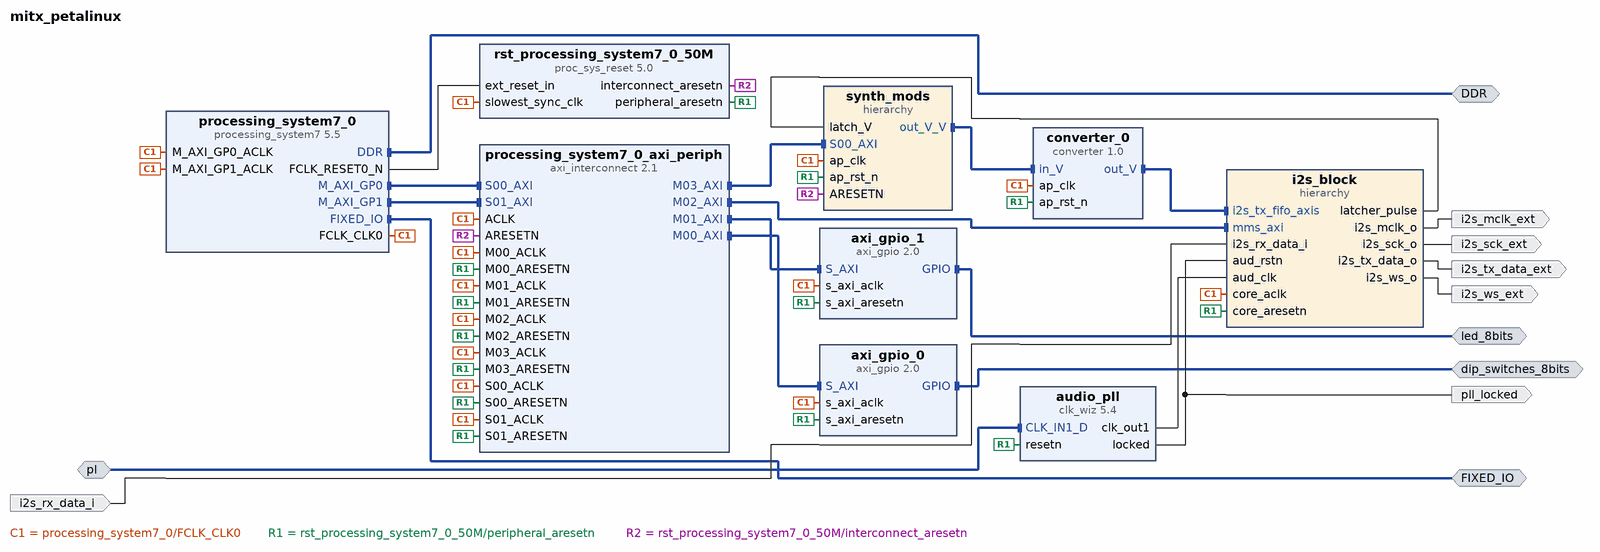
[diagram p0: block diagram of the top level]
# Vivado block design mitx_petalinux, xc7z100ffg900-1, Vivado 2017.2
create_bd_design mitx_petalinux

create_bd_intf_port -mode Master -vlnv xilinx.com:interface:ddrx_rtl:1.0 DDR
create_bd_intf_port -mode Master -vlnv xilinx.com:display_processing_system7:fixedio_rtl:1.0 FIXED_IO
create_bd_intf_port -mode Master -vlnv xilinx.com:interface:gpio_rtl:1.0 dip_switches_8bits
create_bd_intf_port -mode Master -vlnv xilinx.com:interface:gpio_rtl:1.0 led_8bits
create_bd_intf_port -mode Slave -vlnv xilinx.com:interface:diff_clock_rtl:1.0 pl
set_property -dict {CONFIG.FREQ_HZ 200000000} [get_bd_intf_ports pl]
create_bd_port -dir O i2s_sck_ext
create_bd_port -dir O i2s_ws_ext
create_bd_port -dir O i2s_mclk_ext
create_bd_port -dir O i2s_tx_data_ext
create_bd_port -dir I i2s_rx_data_i
create_bd_port -dir O pll_locked

create_bd_cell -type hier i2s_block
create_bd_cell -type ip -vlnv xilinx.com:ip:axi_gpio:2.0 axi_gpio_0
set_property -dict {CONFIG.C_GPIO_WIDTH 8 CONFIG.C_ALL_INPUTS 1} [get_bd_cells axi_gpio_0]
create_bd_cell -type ip -vlnv xilinx.com:ip:axi_gpio:2.0 axi_gpio_1
set_property -dict {CONFIG.C_GPIO_WIDTH 7 CONFIG.C_ALL_OUTPUTS 1} [get_bd_cells axi_gpio_1]
create_bd_cell -type ip -vlnv xilinx.com:ip:clk_wiz:5.4 audio_pll
set_property -dict [list \
  CONFIG.ENABLE_CLOCK_MONITOR false \
  CONFIG.REF_CLK_FREQ 200 \
  CONFIG.PRIMITIVE MMCM \
  CONFIG.PRIM_IN_FREQ 200 \
  CONFIG.JITTER_OPTIONS UI \
  CONFIG.CLKIN1_UI_JITTER 0.050 \
  CONFIG.CLKIN2_UI_JITTER 0.010 \
  CONFIG.CLKIN1_JITTER_PS 250.0 \
  CONFIG.CLKIN2_JITTER_PS 100.0 \
  CONFIG.CLKOUT2_USED false \
  CONFIG.NUM_OUT_CLKS 1 \
  CONFIG.CLKOUT1_REQUESTED_OUT_FREQ 12.288 \
  CONFIG.CLKOUT2_REQUESTED_OUT_FREQ 100.000 \
  CONFIG.PRIM_SOURCE Differential_clock_capable_pin \
  CONFIG.CLKOUT1_DRIVES BUFG \
  CONFIG.CLKOUT2_DRIVES BUFG \
  CONFIG.CLKOUT3_DRIVES BUFG \
  CONFIG.CLKOUT4_DRIVES BUFG \
  CONFIG.CLKOUT5_DRIVES BUFG \
  CONFIG.CLKOUT6_DRIVES BUFG \
  CONFIG.CLKOUT7_DRIVES BUFG \
  CONFIG.FEEDBACK_SOURCE FDBK_AUTO \
  CONFIG.RESET_PORT resetn \
  CONFIG.MMCM_DIVCLK_DIVIDE 9 \
  CONFIG.MMCM_CLKFBOUT_MULT_F 44.375 \
  CONFIG.MMCM_CLKIN1_PERIOD 5.000 \
  CONFIG.MMCM_CLKIN2_PERIOD 10.0 \
  CONFIG.MMCM_COMPENSATION ZHOLD \
  CONFIG.MMCM_REF_JITTER1 0.050 \
  CONFIG.MMCM_REF_JITTER2 0.010 \
  CONFIG.MMCM_CLKOUT0_DIVIDE_F 80.250 \
  CONFIG.MMCM_CLKOUT1_DIVIDE 1 \
  CONFIG.RESET_TYPE ACTIVE_LOW \
  CONFIG.CLKOUT1_JITTER 569.507 \
  CONFIG.CLKOUT1_PHASE_ERROR 264.435 \
  CONFIG.CLKOUT2_JITTER 143.127 \
  CONFIG.CLKOUT2_PHASE_ERROR 134.075 \
] [get_bd_cells audio_pll]
create_bd_cell -type ip -vlnv xilinx.com:ip:processing_system7:5.5 processing_system7_0
set_property -dict [list \
  CONFIG.PCW_UIPARAM_DDR_FREQ_MHZ 533.333313 \
  CONFIG.PCW_APU_PERIPHERAL_FREQMHZ 667.000000 \
  CONFIG.PCW_SDIO_PERIPHERAL_FREQMHZ 50 \
  CONFIG.PCW_UART_PERIPHERAL_FREQMHZ 50 \
  CONFIG.PCW_I2C_PERIPHERAL_FREQMHZ 111.111115 \
  CONFIG.PCW_FPGA0_PERIPHERAL_FREQMHZ 100 \
  CONFIG.PCW_USE_M_AXI_GP1 1 \
  CONFIG.PCW_GP0_EN_MODIFIABLE_TXN 0 \
  CONFIG.PCW_GP1_EN_MODIFIABLE_TXN 0 \
  CONFIG.PCW_PERIPHERAL_BOARD_PRESET part0 \
  CONFIG.PCW_PRESET_BANK0_VOLTAGE {LVCMOS 1.8V} \
  CONFIG.PCW_PRESET_BANK1_VOLTAGE {LVCMOS 1.8V} \
  CONFIG.PCW_UIPARAM_DDR_PARTNO Custom \
  CONFIG.PCW_QSPI_PERIPHERAL_ENABLE 1 \
  CONFIG.PCW_QSPI_QSPI_IO {MIO 1 .. 6} \
  CONFIG.PCW_QSPI_GRP_SINGLE_SS_ENABLE 1 \
  CONFIG.PCW_QSPI_GRP_SINGLE_SS_IO {MIO 1 .. 6} \
  CONFIG.PCW_QSPI_GRP_FBCLK_ENABLE 1 \
  CONFIG.PCW_QSPI_GRP_FBCLK_IO {MIO 8} \
  CONFIG.PCW_ENET0_PERIPHERAL_ENABLE 1 \
  CONFIG.PCW_ENET0_ENET0_IO {MIO 16 .. 27} \
  CONFIG.PCW_ENET0_GRP_MDIO_ENABLE 1 \
  CONFIG.PCW_ENET0_GRP_MDIO_IO {MIO 52 .. 53} \
  CONFIG.PCW_ENET_RESET_ENABLE 1 \
  CONFIG.PCW_ENET_RESET_SELECT {Share reset pin} \
  CONFIG.PCW_ENET0_RESET_ENABLE 1 \
  CONFIG.PCW_ENET0_RESET_IO {MIO 47} \
  CONFIG.PCW_SD0_PERIPHERAL_ENABLE 1 \
  CONFIG.PCW_SD0_SD0_IO {MIO 40 .. 45} \
  CONFIG.PCW_SD0_GRP_CD_ENABLE 1 \
  CONFIG.PCW_SD0_GRP_CD_IO {MIO 14} \
  CONFIG.PCW_SD0_GRP_WP_ENABLE 1 \
  CONFIG.PCW_SD0_GRP_WP_IO EMIO \
  CONFIG.PCW_UART1_PERIPHERAL_ENABLE 1 \
  CONFIG.PCW_UART1_UART1_IO {MIO 48 .. 49} \
  CONFIG.PCW_TTC0_PERIPHERAL_ENABLE 1 \
  CONFIG.PCW_TTC0_TTC0_IO EMIO \
  CONFIG.PCW_PJTAG_PERIPHERAL_ENABLE 1 \
  CONFIG.PCW_PJTAG_PJTAG_IO {MIO 10 .. 13} \
  CONFIG.PCW_USB0_PERIPHERAL_ENABLE 1 \
  CONFIG.PCW_USB0_USB0_IO {MIO 28 .. 39} \
  CONFIG.PCW_USB_RESET_ENABLE 1 \
  CONFIG.PCW_USB_RESET_SELECT {Share reset pin} \
  CONFIG.PCW_USB0_RESET_ENABLE 1 \
  CONFIG.PCW_USB0_RESET_IO {MIO 7} \
  CONFIG.PCW_I2C0_PERIPHERAL_ENABLE 1 \
  CONFIG.PCW_I2C0_I2C0_IO {MIO 50 .. 51} \
  CONFIG.PCW_I2C0_RESET_ENABLE 1 \
  CONFIG.PCW_I2C0_RESET_IO {MIO 46} \
  CONFIG.PCW_I2C_RESET_ENABLE 1 \
  CONFIG.PCW_I2C_RESET_SELECT {Share reset pin} \
  CONFIG.PCW_GPIO_MIO_GPIO_ENABLE 1 \
  CONFIG.PCW_GPIO_MIO_GPIO_IO MIO \
] [get_bd_cells processing_system7_0]
# 209 more settings of processing_system7_0 are not shown: defaults, MIO pin electricals, DDR timing, and values the tool derives
create_bd_cell -type ip -vlnv xilinx.com:ip:proc_sys_reset:5.0 rst_processing_system7_0_50M
create_bd_cell -type hier synth_mods
create_bd_cell -type ip -vlnv xilinx.com:hls:converter:1.0 converter_0
create_bd_cell -type ip -vlnv xilinx.com:ip:axi_interconnect:2.1 processing_system7_0_axi_periph
set_property -dict {CONFIG.NUM_SI 2 CONFIG.NUM_MI 4} [get_bd_cells processing_system7_0_axi_periph]

# ---- hierarchy /i2s_block ----
current_bd_instance /i2s_block
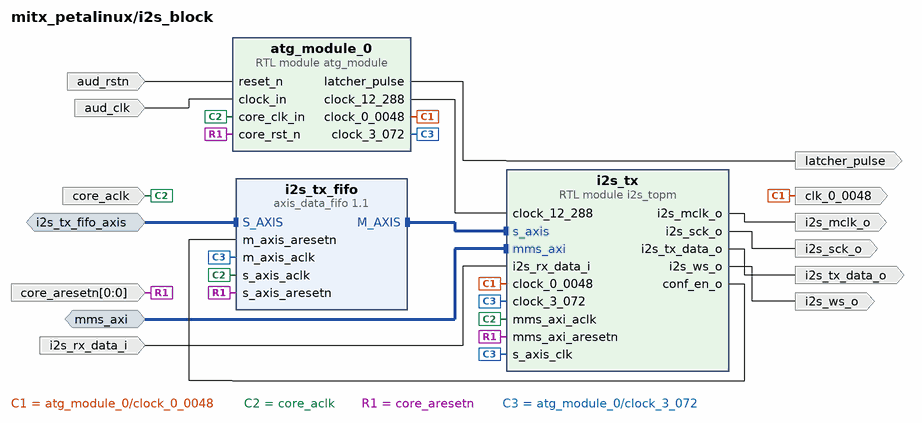
[diagram p1: block diagram inside /i2s_block]
create_bd_intf_pin -mode Slave -vlnv xilinx.com:interface:axis_rtl:1.0 i2s_tx_fifo_axis
create_bd_intf_pin -mode Slave -vlnv xilinx.com:interface:aximm_rtl:1.0 mms_axi
create_bd_pin -dir O i2s_sck_o
create_bd_pin -dir O i2s_ws_o
create_bd_pin -dir O i2s_mclk_o
create_bd_pin -dir O i2s_tx_data_o
create_bd_pin -dir I i2s_rx_data_i
create_bd_pin -dir I -type rst aud_rstn
create_bd_pin -dir I -from 0 -to 0 -type rst core_aresetn
create_bd_pin -dir I -type clk core_aclk
create_bd_pin -dir O clk_0_0048
create_bd_pin -dir O latcher_pulse
create_bd_pin -dir I -type clk aud_clk

create_bd_cell -type ip -vlnv xilinx.com:ip:axis_data_fifo:1.1 i2s_tx_fifo
set_property -dict [list \
  CONFIG.TDATA_NUM_BYTES 4 \
  CONFIG.FIFO_DEPTH 64 \
  CONFIG.FIFO_MODE 1 \
  CONFIG.IS_ACLK_ASYNC 1 \
] [get_bd_cells i2s_tx_fifo]
create_bd_cell -type module -reference atg_module atg_module_0
create_bd_cell -type module -reference i2s_topm i2s_tx

# ---- hierarchy /synth_mods ----
current_bd_instance /synth_mods
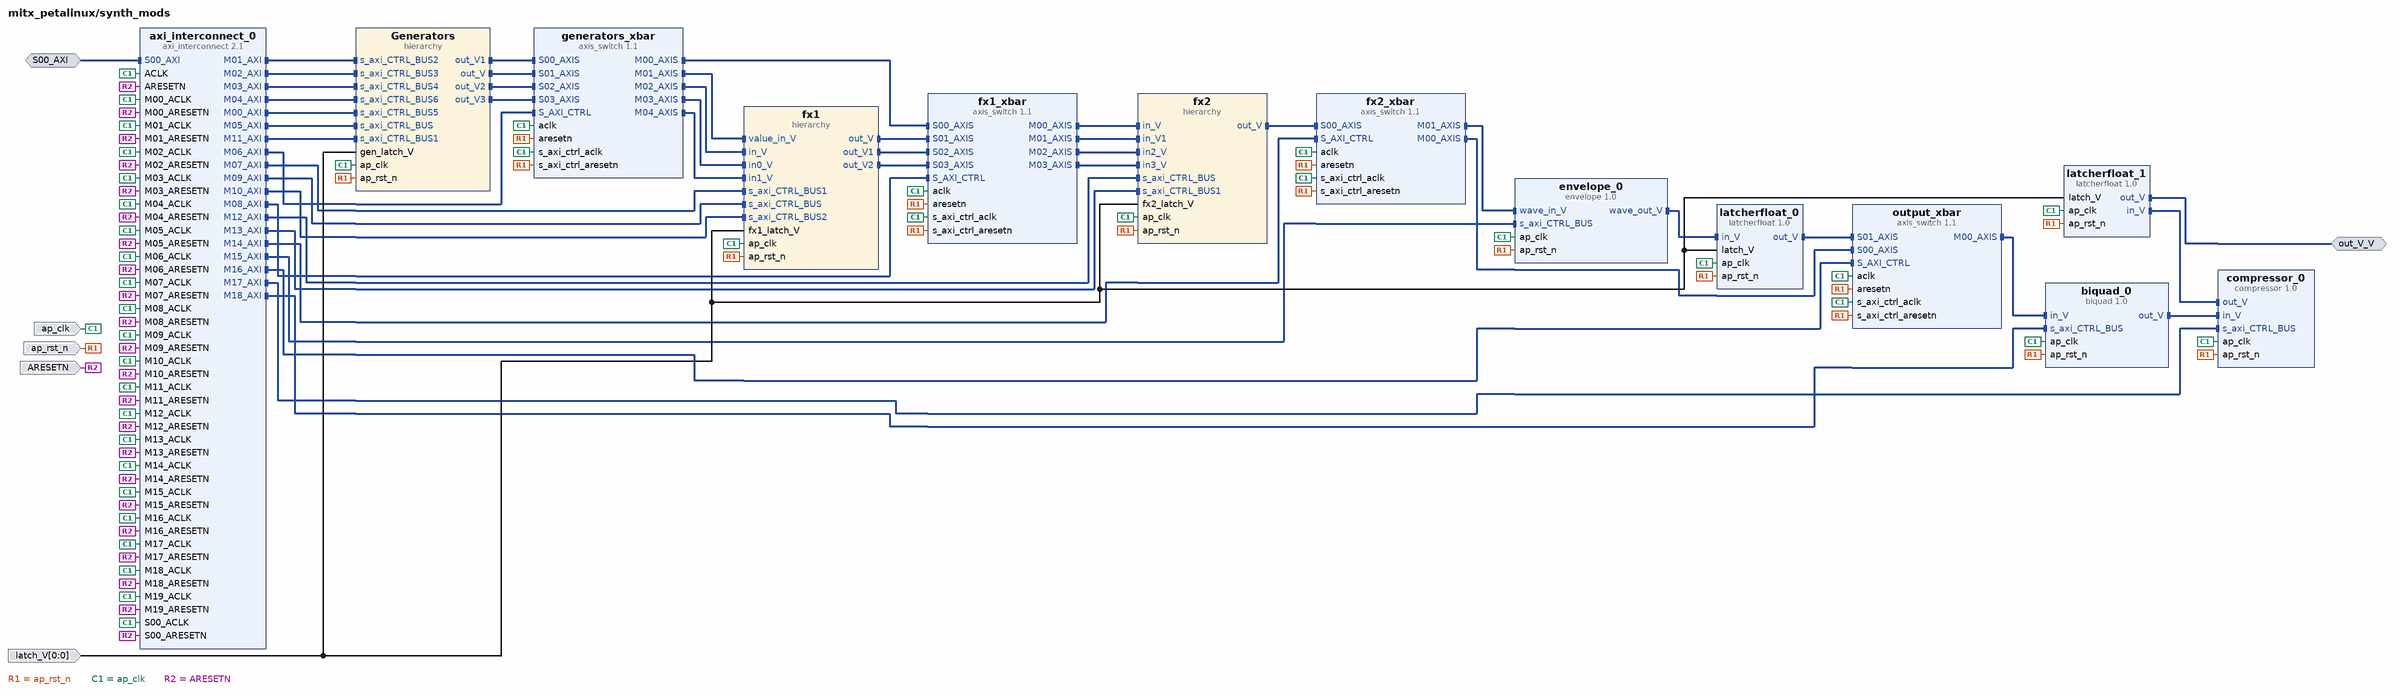
[diagram p2: block diagram inside /synth_mods]
create_bd_intf_pin -mode Master -vlnv xilinx.com:interface:axis_rtl:1.0 out_V_V
create_bd_intf_pin -mode Slave -vlnv xilinx.com:interface:aximm_rtl:1.0 S00_AXI
create_bd_pin -dir I -type clk ap_clk
create_bd_pin -dir I -type rst ap_rst_n
create_bd_pin -dir I -from 0 -to 0 -type data latch_V
create_bd_pin -dir I -type rst ARESETN

create_bd_cell -type ip -vlnv xilinx.com:ip:axis_switch:1.1 generators_xbar
set_property -dict {CONFIG.NUM_SI 4 CONFIG.NUM_MI 5 CONFIG.ROUTING_MODE 1 CONFIG.DECODER_REG 1} [get_bd_cells generators_xbar]
create_bd_cell -type ip -vlnv xilinx.com:ip:axis_switch:1.1 fx1_xbar
set_property -dict {CONFIG.NUM_SI 4 CONFIG.NUM_MI 4 CONFIG.ROUTING_MODE 1 CONFIG.DECODER_REG 1} [get_bd_cells fx1_xbar]
create_bd_cell -type ip -vlnv xilinx.com:ip:axis_switch:1.1 fx2_xbar
set_property -dict {CONFIG.NUM_SI 1 CONFIG.NUM_MI 2 CONFIG.ROUTING_MODE 1 CONFIG.DECODER_REG 1} [get_bd_cells fx2_xbar]
create_bd_cell -type ip -vlnv xilinx.com:ip:axis_switch:1.1 output_xbar
set_property -dict {CONFIG.ROUTING_MODE 1} [get_bd_cells output_xbar]
create_bd_cell -type hier Generators
create_bd_cell -type hier fx1
create_bd_cell -type hier fx2
create_bd_cell -type ip -vlnv xilinx.com:hls:latcherfloat:1.0 latcherfloat_0
create_bd_cell -type ip -vlnv xilinx.com:hls:latcherfloat:1.0 latcherfloat_1
create_bd_cell -type ip -vlnv xilinx.com:ip:axi_interconnect:2.1 axi_interconnect_0
set_property -dict {CONFIG.NUM_MI 20} [get_bd_cells axi_interconnect_0]
create_bd_cell -type ip -vlnv xilinx.com:hls:compressor:1.0 compressor_0
create_bd_cell -type ip -vlnv xilinx.com:hls:biquad:1.0 biquad_0
create_bd_cell -type ip -vlnv xilinx.com:hls:envelope:1.0 envelope_0

# ---- hierarchy /synth_mods/Generators ----
current_bd_instance /synth_mods/Generators
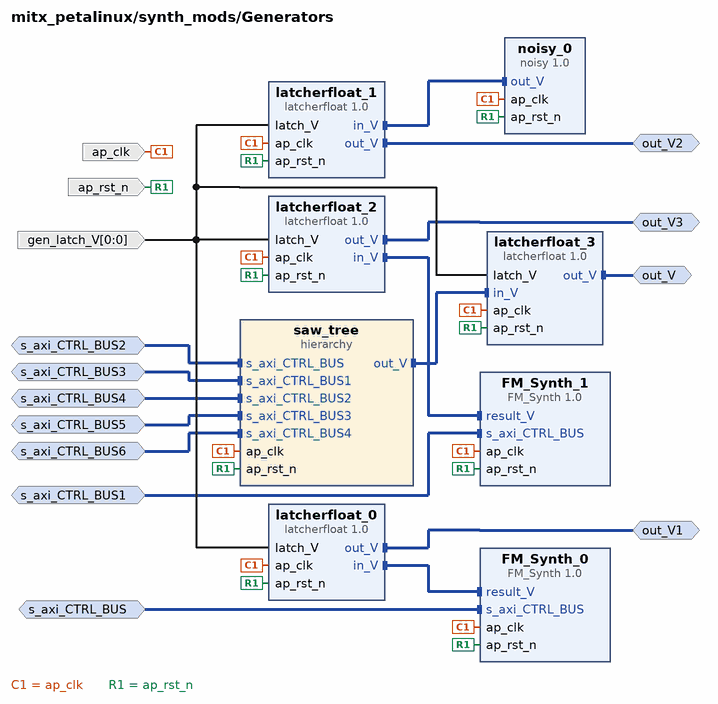
[diagram p3: block diagram inside /synth_mods/Generators]
create_bd_intf_pin -mode Master -vlnv xilinx.com:interface:axis_rtl:1.0 out_V
create_bd_intf_pin -mode Master -vlnv xilinx.com:interface:axis_rtl:1.0 out_V1
create_bd_intf_pin -mode Master -vlnv xilinx.com:interface:axis_rtl:1.0 out_V2
create_bd_intf_pin -mode Slave -vlnv xilinx.com:interface:aximm_rtl:1.0 s_axi_CTRL_BUS
create_bd_intf_pin -mode Slave -vlnv xilinx.com:interface:aximm_rtl:1.0 s_axi_CTRL_BUS1
create_bd_intf_pin -mode Master -vlnv xilinx.com:interface:axis_rtl:1.0 out_V3
create_bd_intf_pin -mode Slave -vlnv xilinx.com:interface:aximm_rtl:1.0 s_axi_CTRL_BUS2
create_bd_intf_pin -mode Slave -vlnv xilinx.com:interface:aximm_rtl:1.0 s_axi_CTRL_BUS3
create_bd_intf_pin -mode Slave -vlnv xilinx.com:interface:aximm_rtl:1.0 s_axi_CTRL_BUS4
create_bd_intf_pin -mode Slave -vlnv xilinx.com:interface:aximm_rtl:1.0 s_axi_CTRL_BUS5
create_bd_intf_pin -mode Slave -vlnv xilinx.com:interface:aximm_rtl:1.0 s_axi_CTRL_BUS6
create_bd_pin -dir I -type clk ap_clk
create_bd_pin -dir I -type rst ap_rst_n
create_bd_pin -dir I -from 0 -to 0 -type data gen_latch_V

create_bd_cell -type ip -vlnv xilinx.com:hls:noisy:1.0 noisy_0
create_bd_cell -type ip -vlnv xilinx.com:hls:FM_Synth:1.0 FM_Synth_0
create_bd_cell -type ip -vlnv xilinx.com:hls:FM_Synth:1.0 FM_Synth_1
create_bd_cell -type hier saw_tree
create_bd_cell -type ip -vlnv xilinx.com:hls:latcherfloat:1.0 latcherfloat_2
create_bd_cell -type ip -vlnv xilinx.com:hls:latcherfloat:1.0 latcherfloat_0
create_bd_cell -type ip -vlnv xilinx.com:hls:latcherfloat:1.0 latcherfloat_1
create_bd_cell -type ip -vlnv xilinx.com:hls:latcherfloat:1.0 latcherfloat_3

# ---- hierarchy /synth_mods/Generators/saw_tree ----
current_bd_instance /synth_mods/Generators/saw_tree
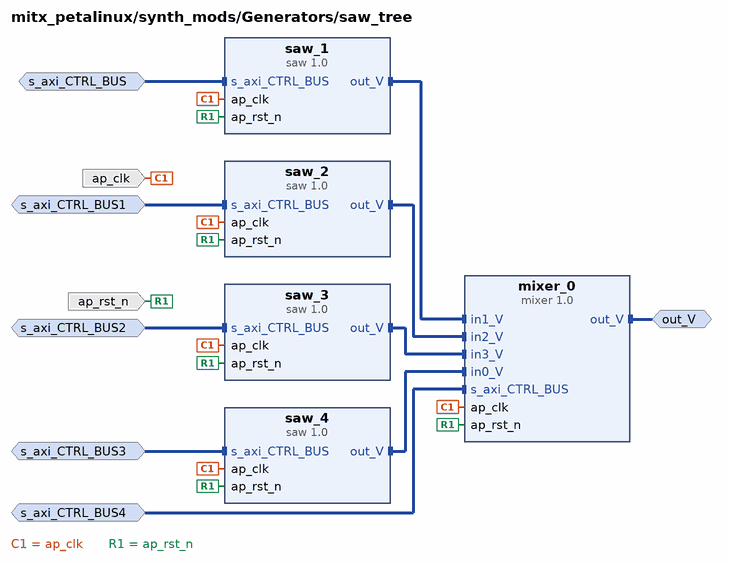
[diagram p4: block diagram inside /synth_mods/Generators/saw_tree]
create_bd_intf_pin -mode Slave -vlnv xilinx.com:interface:aximm_rtl:1.0 s_axi_CTRL_BUS
create_bd_intf_pin -mode Slave -vlnv xilinx.com:interface:aximm_rtl:1.0 s_axi_CTRL_BUS1
create_bd_intf_pin -mode Slave -vlnv xilinx.com:interface:aximm_rtl:1.0 s_axi_CTRL_BUS2
create_bd_intf_pin -mode Slave -vlnv xilinx.com:interface:aximm_rtl:1.0 s_axi_CTRL_BUS3
create_bd_intf_pin -mode Slave -vlnv xilinx.com:interface:aximm_rtl:1.0 s_axi_CTRL_BUS4
create_bd_intf_pin -mode Master -vlnv xilinx.com:interface:axis_rtl:1.0 out_V
create_bd_pin -dir I -type clk ap_clk
create_bd_pin -dir I -type rst ap_rst_n

create_bd_cell -type ip -vlnv xilinx.com:hls:saw:1.0 saw_1
create_bd_cell -type ip -vlnv xilinx.com:hls:saw:1.0 saw_2
create_bd_cell -type ip -vlnv xilinx.com:hls:saw:1.0 saw_3
create_bd_cell -type ip -vlnv xilinx.com:hls:saw:1.0 saw_4
create_bd_cell -type ip -vlnv xilinx.com:hls:mixer:1.0 mixer_0

# ---- hierarchy /synth_mods/fx1 ----
current_bd_instance /synth_mods/fx1
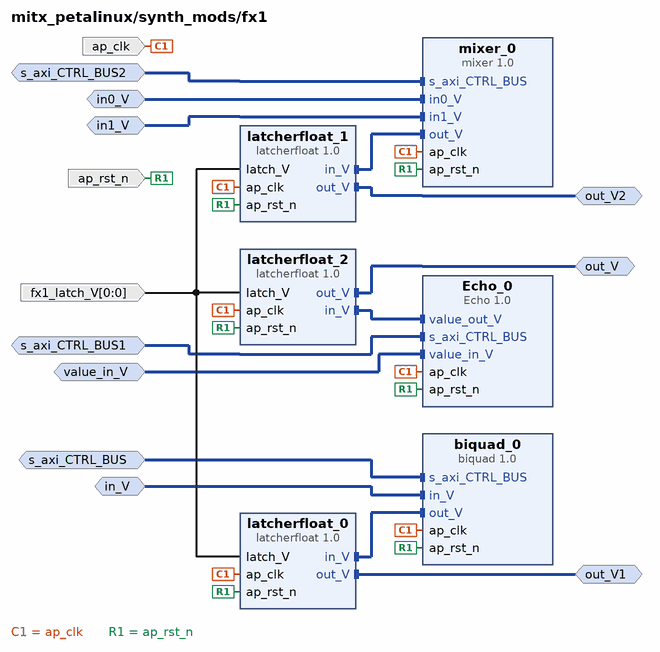
[diagram p5: block diagram inside /synth_mods/fx1]
create_bd_intf_pin -mode Slave -vlnv xilinx.com:interface:aximm_rtl:1.0 s_axi_CTRL_BUS
create_bd_intf_pin -mode Slave -vlnv xilinx.com:interface:axis_rtl:1.0 in_V
create_bd_intf_pin -mode Master -vlnv xilinx.com:interface:axis_rtl:1.0 out_V
create_bd_intf_pin -mode Slave -vlnv xilinx.com:interface:aximm_rtl:1.0 s_axi_CTRL_BUS1
create_bd_intf_pin -mode Slave -vlnv xilinx.com:interface:axis_rtl:1.0 value_in_V
create_bd_intf_pin -mode Master -vlnv xilinx.com:interface:axis_rtl:1.0 out_V1
create_bd_intf_pin -mode Slave -vlnv xilinx.com:interface:aximm_rtl:1.0 s_axi_CTRL_BUS2
create_bd_intf_pin -mode Slave -vlnv xilinx.com:interface:axis_rtl:1.0 in0_V
create_bd_intf_pin -mode Slave -vlnv xilinx.com:interface:axis_rtl:1.0 in1_V
create_bd_intf_pin -mode Master -vlnv xilinx.com:interface:axis_rtl:1.0 out_V2
create_bd_pin -dir I -type clk ap_clk
create_bd_pin -dir I -type rst ap_rst_n
create_bd_pin -dir I -from 0 -to 0 -type data fx1_latch_V

create_bd_cell -type ip -vlnv xilinx.com:hls:biquad:1.0 biquad_0
create_bd_cell -type ip -vlnv xilinx.com:hls:latcherfloat:1.0 latcherfloat_0
create_bd_cell -type ip -vlnv xilinx.com:hls:latcherfloat:1.0 latcherfloat_1
create_bd_cell -type ip -vlnv xilinx.com:hls:latcherfloat:1.0 latcherfloat_2
create_bd_cell -type ip -vlnv xilinx.com:hls:Echo:1.0 Echo_0
create_bd_cell -type ip -vlnv xilinx.com:hls:mixer:1.0 mixer_0

# ---- hierarchy /synth_mods/fx2 ----
current_bd_instance /synth_mods/fx2
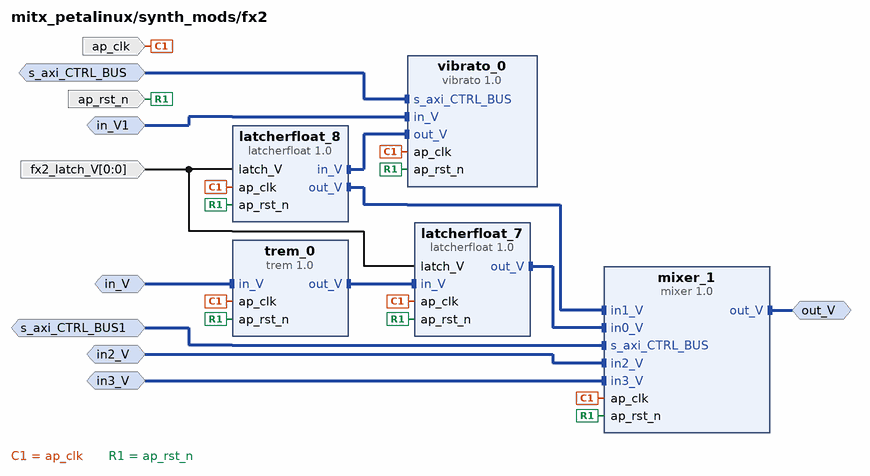
[diagram p6: block diagram inside /synth_mods/fx2]
create_bd_intf_pin -mode Slave -vlnv xilinx.com:interface:axis_rtl:1.0 in_V
create_bd_intf_pin -mode Slave -vlnv xilinx.com:interface:aximm_rtl:1.0 s_axi_CTRL_BUS
create_bd_intf_pin -mode Slave -vlnv xilinx.com:interface:axis_rtl:1.0 in_V1
create_bd_intf_pin -mode Slave -vlnv xilinx.com:interface:aximm_rtl:1.0 s_axi_CTRL_BUS1
create_bd_intf_pin -mode Slave -vlnv xilinx.com:interface:axis_rtl:1.0 in2_V
create_bd_intf_pin -mode Slave -vlnv xilinx.com:interface:axis_rtl:1.0 in3_V
create_bd_intf_pin -mode Master -vlnv xilinx.com:interface:axis_rtl:1.0 out_V
create_bd_pin -dir I -from 0 -to 0 -type data fx2_latch_V
create_bd_pin -dir I -type clk ap_clk
create_bd_pin -dir I -type rst ap_rst_n

create_bd_cell -type ip -vlnv xilinx.com:hls:latcherfloat:1.0 latcherfloat_7
create_bd_cell -type ip -vlnv xilinx.com:hls:latcherfloat:1.0 latcherfloat_8
create_bd_cell -type ip -vlnv xilinx.com:hls:mixer:1.0 mixer_1
create_bd_cell -type ip -vlnv xilinx.com:hls:trem:1.0 trem_0
create_bd_cell -type ip -vlnv xilinx.com:hls:vibrato:1.0 vibrato_0

# ---- connections ----

current_bd_instance /i2s_block
connect_bd_intf_net [get_bd_intf_pins i2s_tx/s_axis] [get_bd_intf_pins i2s_tx_fifo/M_AXIS]
connect_bd_intf_net [get_bd_intf_pins i2s_tx_fifo_axis] [get_bd_intf_pins i2s_tx_fifo/S_AXIS]
connect_bd_intf_net [get_bd_intf_pins mms_axi] [get_bd_intf_pins i2s_tx/mms_axi]
connect_bd_net [get_bd_pins i2s_tx/i2s_sck_o] [get_bd_pins i2s_sck_o]
connect_bd_net [get_bd_pins i2s_tx/i2s_ws_o] [get_bd_pins i2s_ws_o]
connect_bd_net [get_bd_pins i2s_tx/i2s_mclk_o] [get_bd_pins i2s_mclk_o]
connect_bd_net [get_bd_pins i2s_tx/i2s_tx_data_o] [get_bd_pins i2s_tx_data_o]
connect_bd_net [get_bd_pins i2s_rx_data_i] [get_bd_pins i2s_tx/i2s_rx_data_i]
connect_bd_net -net atg_module_0_clk_0_0048 [get_bd_pins atg_module_0/clock_0_0048] [get_bd_pins clk_0_0048] [get_bd_pins i2s_tx/clock_0_0048]
connect_bd_net [get_bd_pins aud_rstn] [get_bd_pins atg_module_0/reset_n]
connect_bd_net [get_bd_pins core_aclk] [get_bd_pins i2s_tx_fifo/s_axis_aclk] [get_bd_pins atg_module_0/core_clk_in] [get_bd_pins i2s_tx/mms_axi_aclk]
connect_bd_net [get_bd_pins core_aresetn] \
  [get_bd_pins i2s_tx_fifo/s_axis_aresetn] [get_bd_pins atg_module_0/core_rst_n] [get_bd_pins i2s_tx/mms_axi_aresetn]
connect_bd_net [get_bd_pins atg_module_0/latcher_pulse] [get_bd_pins latcher_pulse]
connect_bd_net -net m_axis_aclk_1 [get_bd_pins aud_clk] [get_bd_pins atg_module_0/clock_in]
connect_bd_net [get_bd_pins i2s_tx/conf_en_o] [get_bd_pins i2s_tx_fifo/m_axis_aresetn]
connect_bd_net -net atg_module_0_clk_3_072 [get_bd_pins atg_module_0/clock_3_072] \
  [get_bd_pins i2s_tx_fifo/m_axis_aclk] [get_bd_pins i2s_tx/clock_3_072] [get_bd_pins i2s_tx/s_axis_clk]
connect_bd_net [get_bd_pins atg_module_0/clock_12_288] [get_bd_pins i2s_tx/clock_12_288]

current_bd_instance /synth_mods
connect_bd_intf_net [get_bd_intf_pins axi_interconnect_0/M01_AXI] [get_bd_intf_pins Generators/s_axi_CTRL_BUS2]
connect_bd_intf_net [get_bd_intf_pins Generators/s_axi_CTRL_BUS3] [get_bd_intf_pins axi_interconnect_0/M02_AXI]
connect_bd_intf_net [get_bd_intf_pins Generators/s_axi_CTRL_BUS4] [get_bd_intf_pins axi_interconnect_0/M03_AXI]
connect_bd_intf_net [get_bd_intf_pins Generators/s_axi_CTRL_BUS6] [get_bd_intf_pins axi_interconnect_0/M04_AXI]
connect_bd_intf_net [get_bd_intf_pins axi_interconnect_0/M00_AXI] [get_bd_intf_pins Generators/s_axi_CTRL_BUS5]
connect_bd_intf_net [get_bd_intf_pins axi_interconnect_0/M05_AXI] [get_bd_intf_pins Generators/s_axi_CTRL_BUS]
connect_bd_intf_net -intf_net latcherfloat_1_out_V [get_bd_intf_pins generators_xbar/S00_AXIS] [get_bd_intf_pins Generators/out_V1]
connect_bd_intf_net -intf_net latcherfloat_0_out_V [get_bd_intf_pins generators_xbar/S01_AXIS] [get_bd_intf_pins Generators/out_V]
connect_bd_intf_net -intf_net axis_switch_0_M01_AXIS [get_bd_intf_pins fx1/value_in_V] [get_bd_intf_pins generators_xbar/M01_AXIS]
connect_bd_intf_net [get_bd_intf_pins generators_xbar/S_AXI_CTRL] [get_bd_intf_pins axi_interconnect_0/M06_AXI]
connect_bd_intf_net [get_bd_intf_pins fx1/s_axi_CTRL_BUS1] [get_bd_intf_pins axi_interconnect_0/M07_AXI]
connect_bd_intf_net -intf_net latcherfloat_2_out_V [get_bd_intf_pins fx1_xbar/S01_AXIS] [get_bd_intf_pins fx1/out_V]
connect_bd_intf_net -intf_net axis_switch_0_M00_AXIS [get_bd_intf_pins fx1_xbar/S00_AXIS] [get_bd_intf_pins generators_xbar/M00_AXIS]
connect_bd_intf_net [get_bd_intf_pins fx1_xbar/S_AXI_CTRL] [get_bd_intf_pins axi_interconnect_0/M08_AXI]
connect_bd_intf_net -intf_net latcherfloat_3_out_V [get_bd_intf_pins generators_xbar/S02_AXIS] [get_bd_intf_pins Generators/out_V2]
connect_bd_intf_net [get_bd_intf_pins fx1/s_axi_CTRL_BUS] [get_bd_intf_pins axi_interconnect_0/M09_AXI]
connect_bd_intf_net -intf_net source_xbar_M02_AXIS [get_bd_intf_pins fx1/in_V] [get_bd_intf_pins generators_xbar/M02_AXIS]
connect_bd_intf_net -intf_net latcherfloat_4_out_V [get_bd_intf_pins fx1/out_V1] [get_bd_intf_pins fx1_xbar/S02_AXIS]
connect_bd_intf_net [get_bd_intf_pins fx1/s_axi_CTRL_BUS2] [get_bd_intf_pins axi_interconnect_0/M10_AXI]
connect_bd_intf_net -intf_net source_xbar_M03_AXIS [get_bd_intf_pins generators_xbar/M03_AXIS] [get_bd_intf_pins fx1/in0_V]
connect_bd_intf_net -intf_net source_xbar_M04_AXIS [get_bd_intf_pins generators_xbar/M04_AXIS] [get_bd_intf_pins fx1/in1_V]
connect_bd_intf_net -intf_net latcherfloat_5_out_V [get_bd_intf_pins fx1/out_V2] [get_bd_intf_pins fx1_xbar/S03_AXIS]
connect_bd_intf_net [get_bd_intf_pins Generators/s_axi_CTRL_BUS1] [get_bd_intf_pins axi_interconnect_0/M11_AXI]
connect_bd_intf_net -intf_net latcherfloat_6_out_V [get_bd_intf_pins Generators/out_V3] [get_bd_intf_pins generators_xbar/S03_AXIS]
connect_bd_intf_net -intf_net xbar_s1_M00_AXIS [get_bd_intf_pins fx1_xbar/M00_AXIS] [get_bd_intf_pins fx2/in_V]
connect_bd_intf_net -intf_net xbar_s1_M01_AXIS [get_bd_intf_pins fx2/in_V1] [get_bd_intf_pins fx1_xbar/M01_AXIS]
connect_bd_intf_net -intf_net xbar_s1_M02_AXIS [get_bd_intf_pins fx2/in2_V] [get_bd_intf_pins fx1_xbar/M02_AXIS]
connect_bd_intf_net -intf_net xbar_s1_M03_AXIS [get_bd_intf_pins fx2/in3_V] [get_bd_intf_pins fx1_xbar/M03_AXIS]
connect_bd_intf_net [get_bd_intf_pins fx2/s_axi_CTRL_BUS] [get_bd_intf_pins axi_interconnect_0/M12_AXI]
connect_bd_intf_net [get_bd_intf_pins fx2/s_axi_CTRL_BUS1] [get_bd_intf_pins axi_interconnect_0/M13_AXI]
connect_bd_intf_net -intf_net mixer_1_out_V [get_bd_intf_pins fx2/out_V] [get_bd_intf_pins fx2_xbar/S00_AXIS]
connect_bd_intf_net [get_bd_intf_pins fx2_xbar/S_AXI_CTRL] [get_bd_intf_pins axi_interconnect_0/M14_AXI]
connect_bd_intf_net -intf_net axis_switch_0_M00_AXIS1 [get_bd_intf_pins output_xbar/S00_AXIS] [get_bd_intf_pins fx2_xbar/M00_AXIS]
connect_bd_intf_net -intf_net axis_switch_0_M01_AXIS1 [get_bd_intf_pins envelope_0/wave_in_V] [get_bd_intf_pins fx2_xbar/M01_AXIS]
connect_bd_intf_net [get_bd_intf_pins envelope_0/s_axi_CTRL_BUS] [get_bd_intf_pins axi_interconnect_0/M15_AXI]
connect_bd_intf_net [get_bd_intf_pins output_xbar/S_AXI_CTRL] [get_bd_intf_pins axi_interconnect_0/M16_AXI]
connect_bd_intf_net [get_bd_intf_pins envelope_0/wave_out_V] [get_bd_intf_pins latcherfloat_0/in_V]
connect_bd_intf_net [get_bd_intf_pins latcherfloat_0/out_V] [get_bd_intf_pins output_xbar/S01_AXIS]
connect_bd_intf_net [get_bd_intf_pins axi_interconnect_0/M17_AXI] [get_bd_intf_pins compressor_0/s_axi_CTRL_BUS]
connect_bd_intf_net [get_bd_intf_pins latcherfloat_1/in_V] [get_bd_intf_pins compressor_0/out_V]
connect_bd_intf_net [get_bd_intf_pins output_xbar/M00_AXIS] [get_bd_intf_pins biquad_0/in_V]
connect_bd_intf_net [get_bd_intf_pins biquad_0/s_axi_CTRL_BUS] [get_bd_intf_pins axi_interconnect_0/M18_AXI]
connect_bd_intf_net [get_bd_intf_pins biquad_0/out_V] [get_bd_intf_pins compressor_0/in_V]
connect_bd_intf_net [get_bd_intf_pins out_V_V] [get_bd_intf_pins latcherfloat_1/out_V]
connect_bd_intf_net [get_bd_intf_pins S00_AXI] [get_bd_intf_pins axi_interconnect_0/S00_AXI]
connect_bd_net [get_bd_pins ap_rst_n] \
  [get_bd_pins generators_xbar/aresetn] [get_bd_pins generators_xbar/s_axi_ctrl_aresetn] [get_bd_pins fx1_xbar/aresetn] \
  [get_bd_pins fx1_xbar/s_axi_ctrl_aresetn] [get_bd_pins fx2_xbar/aresetn] [get_bd_pins fx2_xbar/s_axi_ctrl_aresetn] \
  [get_bd_pins output_xbar/aresetn] [get_bd_pins output_xbar/s_axi_ctrl_aresetn] [get_bd_pins latcherfloat_0/ap_rst_n] \
  [get_bd_pins latcherfloat_1/ap_rst_n] [get_bd_pins compressor_0/ap_rst_n] [get_bd_pins biquad_0/ap_rst_n] \
  [get_bd_pins envelope_0/ap_rst_n] [get_bd_pins Generators/ap_rst_n] [get_bd_pins fx1/ap_rst_n] [get_bd_pins fx2/ap_rst_n]
connect_bd_net [get_bd_pins ap_clk] \
  [get_bd_pins generators_xbar/aclk] [get_bd_pins generators_xbar/s_axi_ctrl_aclk] [get_bd_pins fx1_xbar/aclk] \
  [get_bd_pins fx1_xbar/s_axi_ctrl_aclk] [get_bd_pins fx2_xbar/aclk] [get_bd_pins fx2_xbar/s_axi_ctrl_aclk] \
  [get_bd_pins output_xbar/aclk] [get_bd_pins output_xbar/s_axi_ctrl_aclk] [get_bd_pins latcherfloat_0/ap_clk] \
  [get_bd_pins latcherfloat_1/ap_clk] [get_bd_pins compressor_0/ap_clk] [get_bd_pins biquad_0/ap_clk] \
  [get_bd_pins envelope_0/ap_clk] [get_bd_pins Generators/ap_clk] [get_bd_pins fx1/ap_clk] [get_bd_pins fx2/ap_clk] \
  [get_bd_pins axi_interconnect_0/ACLK] [get_bd_pins axi_interconnect_0/S00_ACLK] [get_bd_pins axi_interconnect_0/M00_ACLK] \
  [get_bd_pins axi_interconnect_0/M01_ACLK] [get_bd_pins axi_interconnect_0/M02_ACLK] \
  [get_bd_pins axi_interconnect_0/M03_ACLK] [get_bd_pins axi_interconnect_0/M04_ACLK] \
  [get_bd_pins axi_interconnect_0/M05_ACLK] [get_bd_pins axi_interconnect_0/M06_ACLK] \
  [get_bd_pins axi_interconnect_0/M07_ACLK] [get_bd_pins axi_interconnect_0/M08_ACLK] \
  [get_bd_pins axi_interconnect_0/M09_ACLK] [get_bd_pins axi_interconnect_0/M10_ACLK] \
  [get_bd_pins axi_interconnect_0/M11_ACLK] [get_bd_pins axi_interconnect_0/M12_ACLK] \
  [get_bd_pins axi_interconnect_0/M13_ACLK] [get_bd_pins axi_interconnect_0/M14_ACLK] \
  [get_bd_pins axi_interconnect_0/M15_ACLK] [get_bd_pins axi_interconnect_0/M16_ACLK] \
  [get_bd_pins axi_interconnect_0/M17_ACLK] [get_bd_pins axi_interconnect_0/M18_ACLK] \
  [get_bd_pins axi_interconnect_0/M19_ACLK]
connect_bd_net [get_bd_pins ARESETN] \
  [get_bd_pins axi_interconnect_0/ARESETN] [get_bd_pins axi_interconnect_0/S00_ARESETN] \
  [get_bd_pins axi_interconnect_0/M00_ARESETN] [get_bd_pins axi_interconnect_0/M01_ARESETN] \
  [get_bd_pins axi_interconnect_0/M02_ARESETN] [get_bd_pins axi_interconnect_0/M03_ARESETN] \
  [get_bd_pins axi_interconnect_0/M04_ARESETN] [get_bd_pins axi_interconnect_0/M05_ARESETN] \
  [get_bd_pins axi_interconnect_0/M06_ARESETN] [get_bd_pins axi_interconnect_0/M07_ARESETN] \
  [get_bd_pins axi_interconnect_0/M08_ARESETN] [get_bd_pins axi_interconnect_0/M09_ARESETN] \
  [get_bd_pins axi_interconnect_0/M10_ARESETN] [get_bd_pins axi_interconnect_0/M11_ARESETN] \
  [get_bd_pins axi_interconnect_0/M12_ARESETN] [get_bd_pins axi_interconnect_0/M13_ARESETN] \
  [get_bd_pins axi_interconnect_0/M14_ARESETN] [get_bd_pins axi_interconnect_0/M15_ARESETN] \
  [get_bd_pins axi_interconnect_0/M16_ARESETN] [get_bd_pins axi_interconnect_0/M17_ARESETN] \
  [get_bd_pins axi_interconnect_0/M18_ARESETN] [get_bd_pins axi_interconnect_0/M19_ARESETN]
connect_bd_net [get_bd_pins latch_V] \
  [get_bd_pins latcherfloat_0/latch_V] [get_bd_pins latcherfloat_1/latch_V] [get_bd_pins Generators/gen_latch_V] \
  [get_bd_pins fx1/fx1_latch_V] [get_bd_pins fx2/fx2_latch_V]

current_bd_instance /synth_mods/Generators
connect_bd_intf_net [get_bd_intf_pins latcherfloat_2/in_V] [get_bd_intf_pins FM_Synth_1/result_V]
connect_bd_intf_net [get_bd_intf_pins latcherfloat_0/in_V] [get_bd_intf_pins FM_Synth_0/result_V]
connect_bd_intf_net [get_bd_intf_pins latcherfloat_1/in_V] [get_bd_intf_pins noisy_0/out_V]
connect_bd_intf_net [get_bd_intf_pins latcherfloat_3/in_V] [get_bd_intf_pins saw_tree/out_V]
connect_bd_intf_net [get_bd_intf_pins out_V] [get_bd_intf_pins latcherfloat_3/out_V]
connect_bd_intf_net [get_bd_intf_pins out_V1] [get_bd_intf_pins latcherfloat_0/out_V]
connect_bd_intf_net [get_bd_intf_pins out_V2] [get_bd_intf_pins latcherfloat_1/out_V]
connect_bd_intf_net -intf_net axi_interconnect_0_M05_AXI [get_bd_intf_pins s_axi_CTRL_BUS] [get_bd_intf_pins FM_Synth_0/s_axi_CTRL_BUS]
connect_bd_intf_net -intf_net axi_interconnect_0_M11_AXI [get_bd_intf_pins s_axi_CTRL_BUS1] [get_bd_intf_pins FM_Synth_1/s_axi_CTRL_BUS]
connect_bd_intf_net [get_bd_intf_pins out_V3] [get_bd_intf_pins latcherfloat_2/out_V]
connect_bd_intf_net -intf_net axi_interconnect_0_M01_AXI [get_bd_intf_pins s_axi_CTRL_BUS2] [get_bd_intf_pins saw_tree/s_axi_CTRL_BUS]
connect_bd_intf_net -intf_net axi_interconnect_0_M02_AXI [get_bd_intf_pins s_axi_CTRL_BUS3] [get_bd_intf_pins saw_tree/s_axi_CTRL_BUS1]
connect_bd_intf_net -intf_net axi_interconnect_0_M03_AXI [get_bd_intf_pins s_axi_CTRL_BUS4] [get_bd_intf_pins saw_tree/s_axi_CTRL_BUS2]
connect_bd_intf_net -intf_net axi_interconnect_0_M00_AXI [get_bd_intf_pins s_axi_CTRL_BUS5] [get_bd_intf_pins saw_tree/s_axi_CTRL_BUS3]
connect_bd_intf_net -intf_net axi_interconnect_0_M04_AXI [get_bd_intf_pins s_axi_CTRL_BUS6] [get_bd_intf_pins saw_tree/s_axi_CTRL_BUS4]
connect_bd_net [get_bd_pins ap_clk] \
  [get_bd_pins FM_Synth_0/ap_clk] [get_bd_pins FM_Synth_1/ap_clk] [get_bd_pins noisy_0/ap_clk] \
  [get_bd_pins latcherfloat_2/ap_clk] [get_bd_pins latcherfloat_0/ap_clk] [get_bd_pins latcherfloat_1/ap_clk] \
  [get_bd_pins latcherfloat_3/ap_clk] [get_bd_pins saw_tree/ap_clk]
connect_bd_net [get_bd_pins ap_rst_n] \
  [get_bd_pins FM_Synth_0/ap_rst_n] [get_bd_pins FM_Synth_1/ap_rst_n] [get_bd_pins noisy_0/ap_rst_n] \
  [get_bd_pins latcherfloat_2/ap_rst_n] [get_bd_pins latcherfloat_0/ap_rst_n] [get_bd_pins latcherfloat_1/ap_rst_n] \
  [get_bd_pins latcherfloat_3/ap_rst_n] [get_bd_pins saw_tree/ap_rst_n]
connect_bd_net -net latch_V_1 [get_bd_pins gen_latch_V] \
  [get_bd_pins latcherfloat_2/latch_V] [get_bd_pins latcherfloat_0/latch_V] [get_bd_pins latcherfloat_1/latch_V] \
  [get_bd_pins latcherfloat_3/latch_V]

current_bd_instance /synth_mods/Generators/saw_tree
connect_bd_intf_net [get_bd_intf_pins saw_1/out_V] [get_bd_intf_pins mixer_0/in1_V]
connect_bd_intf_net [get_bd_intf_pins saw_2/out_V] [get_bd_intf_pins mixer_0/in2_V]
connect_bd_intf_net [get_bd_intf_pins saw_3/out_V] [get_bd_intf_pins mixer_0/in3_V]
connect_bd_intf_net [get_bd_intf_pins saw_4/out_V] [get_bd_intf_pins mixer_0/in0_V]
connect_bd_intf_net -intf_net axi_interconnect_0_M01_AXI [get_bd_intf_pins s_axi_CTRL_BUS] [get_bd_intf_pins saw_1/s_axi_CTRL_BUS]
connect_bd_intf_net -intf_net axi_interconnect_0_M02_AXI [get_bd_intf_pins s_axi_CTRL_BUS1] [get_bd_intf_pins saw_2/s_axi_CTRL_BUS]
connect_bd_intf_net -intf_net axi_interconnect_0_M03_AXI [get_bd_intf_pins s_axi_CTRL_BUS2] [get_bd_intf_pins saw_3/s_axi_CTRL_BUS]
connect_bd_intf_net -intf_net axi_interconnect_0_M00_AXI [get_bd_intf_pins s_axi_CTRL_BUS3] [get_bd_intf_pins saw_4/s_axi_CTRL_BUS]
connect_bd_intf_net -intf_net axi_interconnect_0_M04_AXI [get_bd_intf_pins s_axi_CTRL_BUS4] [get_bd_intf_pins mixer_0/s_axi_CTRL_BUS]
connect_bd_intf_net [get_bd_intf_pins out_V] [get_bd_intf_pins mixer_0/out_V]
connect_bd_net [get_bd_pins ap_clk] \
  [get_bd_pins saw_3/ap_clk] [get_bd_pins saw_4/ap_clk] [get_bd_pins saw_2/ap_clk] [get_bd_pins saw_1/ap_clk] \
  [get_bd_pins mixer_0/ap_clk]
connect_bd_net [get_bd_pins ap_rst_n] \
  [get_bd_pins saw_2/ap_rst_n] [get_bd_pins saw_3/ap_rst_n] [get_bd_pins saw_4/ap_rst_n] [get_bd_pins saw_1/ap_rst_n] \
  [get_bd_pins mixer_0/ap_rst_n]

current_bd_instance /synth_mods/fx1
connect_bd_intf_net [get_bd_intf_pins latcherfloat_0/in_V] [get_bd_intf_pins biquad_0/out_V]
connect_bd_intf_net [get_bd_intf_pins latcherfloat_1/in_V] [get_bd_intf_pins mixer_0/out_V]
connect_bd_intf_net [get_bd_intf_pins latcherfloat_2/in_V] [get_bd_intf_pins Echo_0/value_out_V]
connect_bd_intf_net -intf_net axi_interconnect_0_M09_AXI [get_bd_intf_pins s_axi_CTRL_BUS] [get_bd_intf_pins biquad_0/s_axi_CTRL_BUS]
connect_bd_intf_net -intf_net source_xbar_M02_AXIS [get_bd_intf_pins in_V] [get_bd_intf_pins biquad_0/in_V]
connect_bd_intf_net [get_bd_intf_pins out_V] [get_bd_intf_pins latcherfloat_2/out_V]
connect_bd_intf_net -intf_net axi_interconnect_0_M07_AXI [get_bd_intf_pins s_axi_CTRL_BUS1] [get_bd_intf_pins Echo_0/s_axi_CTRL_BUS]
connect_bd_intf_net -intf_net axis_switch_0_M01_AXIS [get_bd_intf_pins value_in_V] [get_bd_intf_pins Echo_0/value_in_V]
connect_bd_intf_net [get_bd_intf_pins out_V1] [get_bd_intf_pins latcherfloat_0/out_V]
connect_bd_intf_net -intf_net axi_interconnect_0_M10_AXI [get_bd_intf_pins s_axi_CTRL_BUS2] [get_bd_intf_pins mixer_0/s_axi_CTRL_BUS]
connect_bd_intf_net -intf_net source_xbar_M03_AXIS [get_bd_intf_pins in0_V] [get_bd_intf_pins mixer_0/in0_V]
connect_bd_intf_net -intf_net source_xbar_M04_AXIS [get_bd_intf_pins in1_V] [get_bd_intf_pins mixer_0/in1_V]
connect_bd_intf_net [get_bd_intf_pins out_V2] [get_bd_intf_pins latcherfloat_1/out_V]
connect_bd_net [get_bd_pins ap_clk] \
  [get_bd_pins biquad_0/ap_clk] [get_bd_pins latcherfloat_0/ap_clk] [get_bd_pins latcherfloat_1/ap_clk] \
  [get_bd_pins latcherfloat_2/ap_clk] [get_bd_pins Echo_0/ap_clk] [get_bd_pins mixer_0/ap_clk]
connect_bd_net [get_bd_pins ap_rst_n] \
  [get_bd_pins biquad_0/ap_rst_n] [get_bd_pins latcherfloat_0/ap_rst_n] [get_bd_pins latcherfloat_1/ap_rst_n] \
  [get_bd_pins latcherfloat_2/ap_rst_n] [get_bd_pins Echo_0/ap_rst_n] [get_bd_pins mixer_0/ap_rst_n]
connect_bd_net [get_bd_pins fx1_latch_V] \
  [get_bd_pins latcherfloat_0/latch_V] [get_bd_pins latcherfloat_1/latch_V] [get_bd_pins latcherfloat_2/latch_V]

current_bd_instance /synth_mods/fx2
connect_bd_intf_net [get_bd_intf_pins latcherfloat_8/out_V] [get_bd_intf_pins mixer_1/in1_V]
connect_bd_intf_net [get_bd_intf_pins latcherfloat_7/out_V] [get_bd_intf_pins mixer_1/in0_V]
connect_bd_intf_net [get_bd_intf_pins trem_0/out_V] [get_bd_intf_pins latcherfloat_7/in_V]
connect_bd_intf_net [get_bd_intf_pins latcherfloat_8/in_V] [get_bd_intf_pins vibrato_0/out_V]
connect_bd_intf_net [get_bd_intf_pins in_V] [get_bd_intf_pins trem_0/in_V]
connect_bd_intf_net [get_bd_intf_pins s_axi_CTRL_BUS] [get_bd_intf_pins vibrato_0/s_axi_CTRL_BUS]
connect_bd_intf_net -intf_net in_V1_1 [get_bd_intf_pins in_V1] [get_bd_intf_pins vibrato_0/in_V]
connect_bd_intf_net -intf_net axi_interconnect_0_M13_AXI [get_bd_intf_pins s_axi_CTRL_BUS1] [get_bd_intf_pins mixer_1/s_axi_CTRL_BUS]
connect_bd_intf_net -intf_net xbar_s1_M02_AXIS [get_bd_intf_pins in2_V] [get_bd_intf_pins mixer_1/in2_V]
connect_bd_intf_net -intf_net xbar_s1_M03_AXIS [get_bd_intf_pins in3_V] [get_bd_intf_pins mixer_1/in3_V]
connect_bd_intf_net [get_bd_intf_pins out_V] [get_bd_intf_pins mixer_1/out_V]
connect_bd_net -net latch_V_1 [get_bd_pins fx2_latch_V] [get_bd_pins latcherfloat_7/latch_V] [get_bd_pins latcherfloat_8/latch_V]
connect_bd_net [get_bd_pins ap_clk] \
  [get_bd_pins latcherfloat_7/ap_clk] [get_bd_pins latcherfloat_8/ap_clk] [get_bd_pins mixer_1/ap_clk] \
  [get_bd_pins trem_0/ap_clk] [get_bd_pins vibrato_0/ap_clk]
connect_bd_net [get_bd_pins ap_rst_n] \
  [get_bd_pins latcherfloat_7/ap_rst_n] [get_bd_pins latcherfloat_8/ap_rst_n] [get_bd_pins mixer_1/ap_rst_n] \
  [get_bd_pins trem_0/ap_rst_n] [get_bd_pins vibrato_0/ap_rst_n]

current_bd_instance /
connect_bd_intf_net [get_bd_intf_pins processing_system7_0/M_AXI_GP0] [get_bd_intf_pins processing_system7_0_axi_periph/S00_AXI]
connect_bd_intf_net [get_bd_intf_pins processing_system7_0/M_AXI_GP1] [get_bd_intf_pins processing_system7_0_axi_periph/S01_AXI]
connect_bd_intf_net [get_bd_intf_pins axi_gpio_1/S_AXI] [get_bd_intf_pins processing_system7_0_axi_periph/M01_AXI]
connect_bd_intf_net [get_bd_intf_pins axi_gpio_0/S_AXI] [get_bd_intf_pins processing_system7_0_axi_periph/M00_AXI]
connect_bd_intf_net [get_bd_intf_pins i2s_block/mms_axi] [get_bd_intf_pins processing_system7_0_axi_periph/M02_AXI]
connect_bd_intf_net -intf_net saw_gen_out_V_V [get_bd_intf_pins synth_mods/out_V_V] [get_bd_intf_pins converter_0/in_V]
connect_bd_intf_net [get_bd_intf_pins converter_0/out_V] [get_bd_intf_pins i2s_block/i2s_tx_fifo_axis]
connect_bd_intf_net [get_bd_intf_pins synth_mods/S00_AXI] [get_bd_intf_pins processing_system7_0_axi_periph/M03_AXI]
connect_bd_intf_net [get_bd_intf_ports DDR] [get_bd_intf_pins processing_system7_0/DDR]
connect_bd_intf_net [get_bd_intf_ports FIXED_IO] [get_bd_intf_pins processing_system7_0/FIXED_IO]
connect_bd_intf_net [get_bd_intf_ports dip_switches_8bits] [get_bd_intf_pins axi_gpio_0/GPIO]
connect_bd_intf_net [get_bd_intf_ports led_8bits] [get_bd_intf_pins axi_gpio_1/GPIO]
connect_bd_intf_net [get_bd_intf_ports pl] [get_bd_intf_pins audio_pll/CLK_IN1_D]
connect_bd_net [get_bd_pins processing_system7_0/FCLK_CLK0] \
  [get_bd_pins axi_gpio_0/s_axi_aclk] [get_bd_pins processing_system7_0/M_AXI_GP0_ACLK] \
  [get_bd_pins processing_system7_0/M_AXI_GP1_ACLK] [get_bd_pins rst_processing_system7_0_50M/slowest_sync_clk] \
  [get_bd_pins converter_0/ap_clk] [get_bd_pins axi_gpio_1/s_axi_aclk] [get_bd_pins i2s_block/core_aclk] \
  [get_bd_pins synth_mods/ap_clk] [get_bd_pins processing_system7_0_axi_periph/ACLK] \
  [get_bd_pins processing_system7_0_axi_periph/S00_ACLK] [get_bd_pins processing_system7_0_axi_periph/S01_ACLK] \
  [get_bd_pins processing_system7_0_axi_periph/M00_ACLK] [get_bd_pins processing_system7_0_axi_periph/M01_ACLK] \
  [get_bd_pins processing_system7_0_axi_periph/M02_ACLK] [get_bd_pins processing_system7_0_axi_periph/M03_ACLK]
connect_bd_net [get_bd_pins processing_system7_0/FCLK_RESET0_N] [get_bd_pins rst_processing_system7_0_50M/ext_reset_in]
connect_bd_net [get_bd_pins rst_processing_system7_0_50M/peripheral_aresetn] \
  [get_bd_pins axi_gpio_0/s_axi_aresetn] [get_bd_pins axi_gpio_1/s_axi_aresetn] [get_bd_pins audio_pll/resetn] \
  [get_bd_pins converter_0/ap_rst_n] [get_bd_pins i2s_block/core_aresetn] [get_bd_pins synth_mods/ap_rst_n] \
  [get_bd_pins processing_system7_0_axi_periph/S00_ARESETN] [get_bd_pins processing_system7_0_axi_periph/S01_ARESETN] \
  [get_bd_pins processing_system7_0_axi_periph/M00_ARESETN] [get_bd_pins processing_system7_0_axi_periph/M01_ARESETN] \
  [get_bd_pins processing_system7_0_axi_periph/M02_ARESETN] [get_bd_pins processing_system7_0_axi_periph/M03_ARESETN]
connect_bd_net [get_bd_pins rst_processing_system7_0_50M/interconnect_aresetn] \
  [get_bd_pins synth_mods/ARESETN] [get_bd_pins processing_system7_0_axi_periph/ARESETN]
connect_bd_net [get_bd_pins i2s_block/i2s_sck_o] [get_bd_ports i2s_sck_ext]
connect_bd_net [get_bd_pins i2s_block/i2s_ws_o] [get_bd_ports i2s_ws_ext]
connect_bd_net [get_bd_pins i2s_block/i2s_mclk_o] [get_bd_ports i2s_mclk_ext]
connect_bd_net [get_bd_pins i2s_block/i2s_tx_data_o] [get_bd_ports i2s_tx_data_ext]
connect_bd_net [get_bd_ports i2s_rx_data_i] [get_bd_pins i2s_block/i2s_rx_data_i]
connect_bd_net -net aud_rstn_1 [get_bd_pins audio_pll/locked] [get_bd_ports pll_locked] [get_bd_pins i2s_block/aud_rstn]
connect_bd_net -net latch_V_1 [get_bd_pins i2s_block/latcher_pulse] [get_bd_pins synth_mods/latch_V]
connect_bd_net [get_bd_pins audio_pll/clk_out1] [get_bd_pins i2s_block/aud_clk]

# ---- address map ----
assign_bd_address -offset 0x80000000 -range 4K -target_address_space [get_bd_addr_spaces processing_system7_0/Data] [get_bd_addr_segs synth_mods/Generators/FM_Synth_1/s_axi_CTRL_BUS/Reg]
assign_bd_address -offset 0x80001000 -range 4K -target_address_space [get_bd_addr_spaces processing_system7_0/Data] [get_bd_addr_segs synth_mods/Generators/saw_tree/saw_4/s_axi_CTRL_BUS/Reg]
assign_bd_address -offset 0x80002000 -range 4K -target_address_space [get_bd_addr_spaces processing_system7_0/Data] [get_bd_addr_segs i2s_block/i2s_tx/mms_axi/reg0]
assign_bd_address -offset 0x80003000 -range 4K -target_address_space [get_bd_addr_spaces processing_system7_0/Data] [get_bd_addr_segs synth_mods/Generators/saw_tree/mixer_0/s_axi_CTRL_BUS/Reg]
assign_bd_address -offset 0x80004000 -range 4K -target_address_space [get_bd_addr_spaces processing_system7_0/Data] [get_bd_addr_segs synth_mods/Generators/saw_tree/saw_1/s_axi_CTRL_BUS/Reg]
assign_bd_address -offset 0x80005000 -range 4K -target_address_space [get_bd_addr_spaces processing_system7_0/Data] [get_bd_addr_segs synth_mods/Generators/saw_tree/saw_2/s_axi_CTRL_BUS/Reg]
assign_bd_address -offset 0x80006000 -range 4K -target_address_space [get_bd_addr_spaces processing_system7_0/Data] [get_bd_addr_segs synth_mods/Generators/saw_tree/saw_3/s_axi_CTRL_BUS/Reg]
assign_bd_address -offset 0x80007000 -range 4K -target_address_space [get_bd_addr_spaces processing_system7_0/Data] [get_bd_addr_segs synth_mods/generators_xbar/S_AXI_CTRL/Reg]
assign_bd_address -offset 0x80008000 -range 4K -target_address_space [get_bd_addr_spaces processing_system7_0/Data] [get_bd_addr_segs synth_mods/Generators/FM_Synth_0/s_axi_CTRL_BUS/Reg]
assign_bd_address -offset 0x80009000 -range 4K -target_address_space [get_bd_addr_spaces processing_system7_0/Data] [get_bd_addr_segs synth_mods/fx1/biquad_0/s_axi_CTRL_BUS/Reg]
assign_bd_address -offset 0x8000A000 -range 4K -target_address_space [get_bd_addr_spaces processing_system7_0/Data] [get_bd_addr_segs synth_mods/fx1_xbar/S_AXI_CTRL/Reg]
assign_bd_address -offset 0x8000B000 -range 4K -target_address_space [get_bd_addr_spaces processing_system7_0/Data] [get_bd_addr_segs synth_mods/fx1/Echo_0/s_axi_CTRL_BUS/Reg]
assign_bd_address -offset 0x8000C000 -range 4K -target_address_space [get_bd_addr_spaces processing_system7_0/Data] [get_bd_addr_segs synth_mods/envelope_0/s_axi_CTRL_BUS/Reg]
assign_bd_address -offset 0x8000D000 -range 4K -target_address_space [get_bd_addr_spaces processing_system7_0/Data] [get_bd_addr_segs synth_mods/fx2_xbar/S_AXI_CTRL/Reg]
assign_bd_address -offset 0x8000E000 -range 4K -target_address_space [get_bd_addr_spaces processing_system7_0/Data] [get_bd_addr_segs synth_mods/fx1/mixer_0/s_axi_CTRL_BUS/Reg]
assign_bd_address -offset 0x8000F000 -range 4K -target_address_space [get_bd_addr_spaces processing_system7_0/Data] [get_bd_addr_segs synth_mods/fx2/mixer_1/s_axi_CTRL_BUS/Reg]
assign_bd_address -offset 0x80010000 -range 4K -target_address_space [get_bd_addr_spaces processing_system7_0/Data] [get_bd_addr_segs synth_mods/fx2/vibrato_0/s_axi_CTRL_BUS/Reg]
assign_bd_address -offset 0x80011000 -range 4K -target_address_space [get_bd_addr_spaces processing_system7_0/Data] [get_bd_addr_segs synth_mods/output_xbar/S_AXI_CTRL/Reg]
assign_bd_address -offset 0x80012000 -range 4K -target_address_space [get_bd_addr_spaces processing_system7_0/Data] [get_bd_addr_segs axi_gpio_0/S_AXI/Reg]
assign_bd_address -offset 0x80013000 -range 4K -target_address_space [get_bd_addr_spaces processing_system7_0/Data] [get_bd_addr_segs axi_gpio_1/S_AXI/Reg]
assign_bd_address -offset 0x80020000 -range 4K -target_address_space [get_bd_addr_spaces processing_system7_0/Data] [get_bd_addr_segs synth_mods/compressor_0/s_axi_CTRL_BUS/Reg]
assign_bd_address -offset 0x80021000 -range 4K -target_address_space [get_bd_addr_spaces processing_system7_0/Data] [get_bd_addr_segs synth_mods/biquad_0/s_axi_CTRL_BUS/Reg]

validate_bd_design
save_bd_design
